# Altium project G-Board-G070.PrjPcb
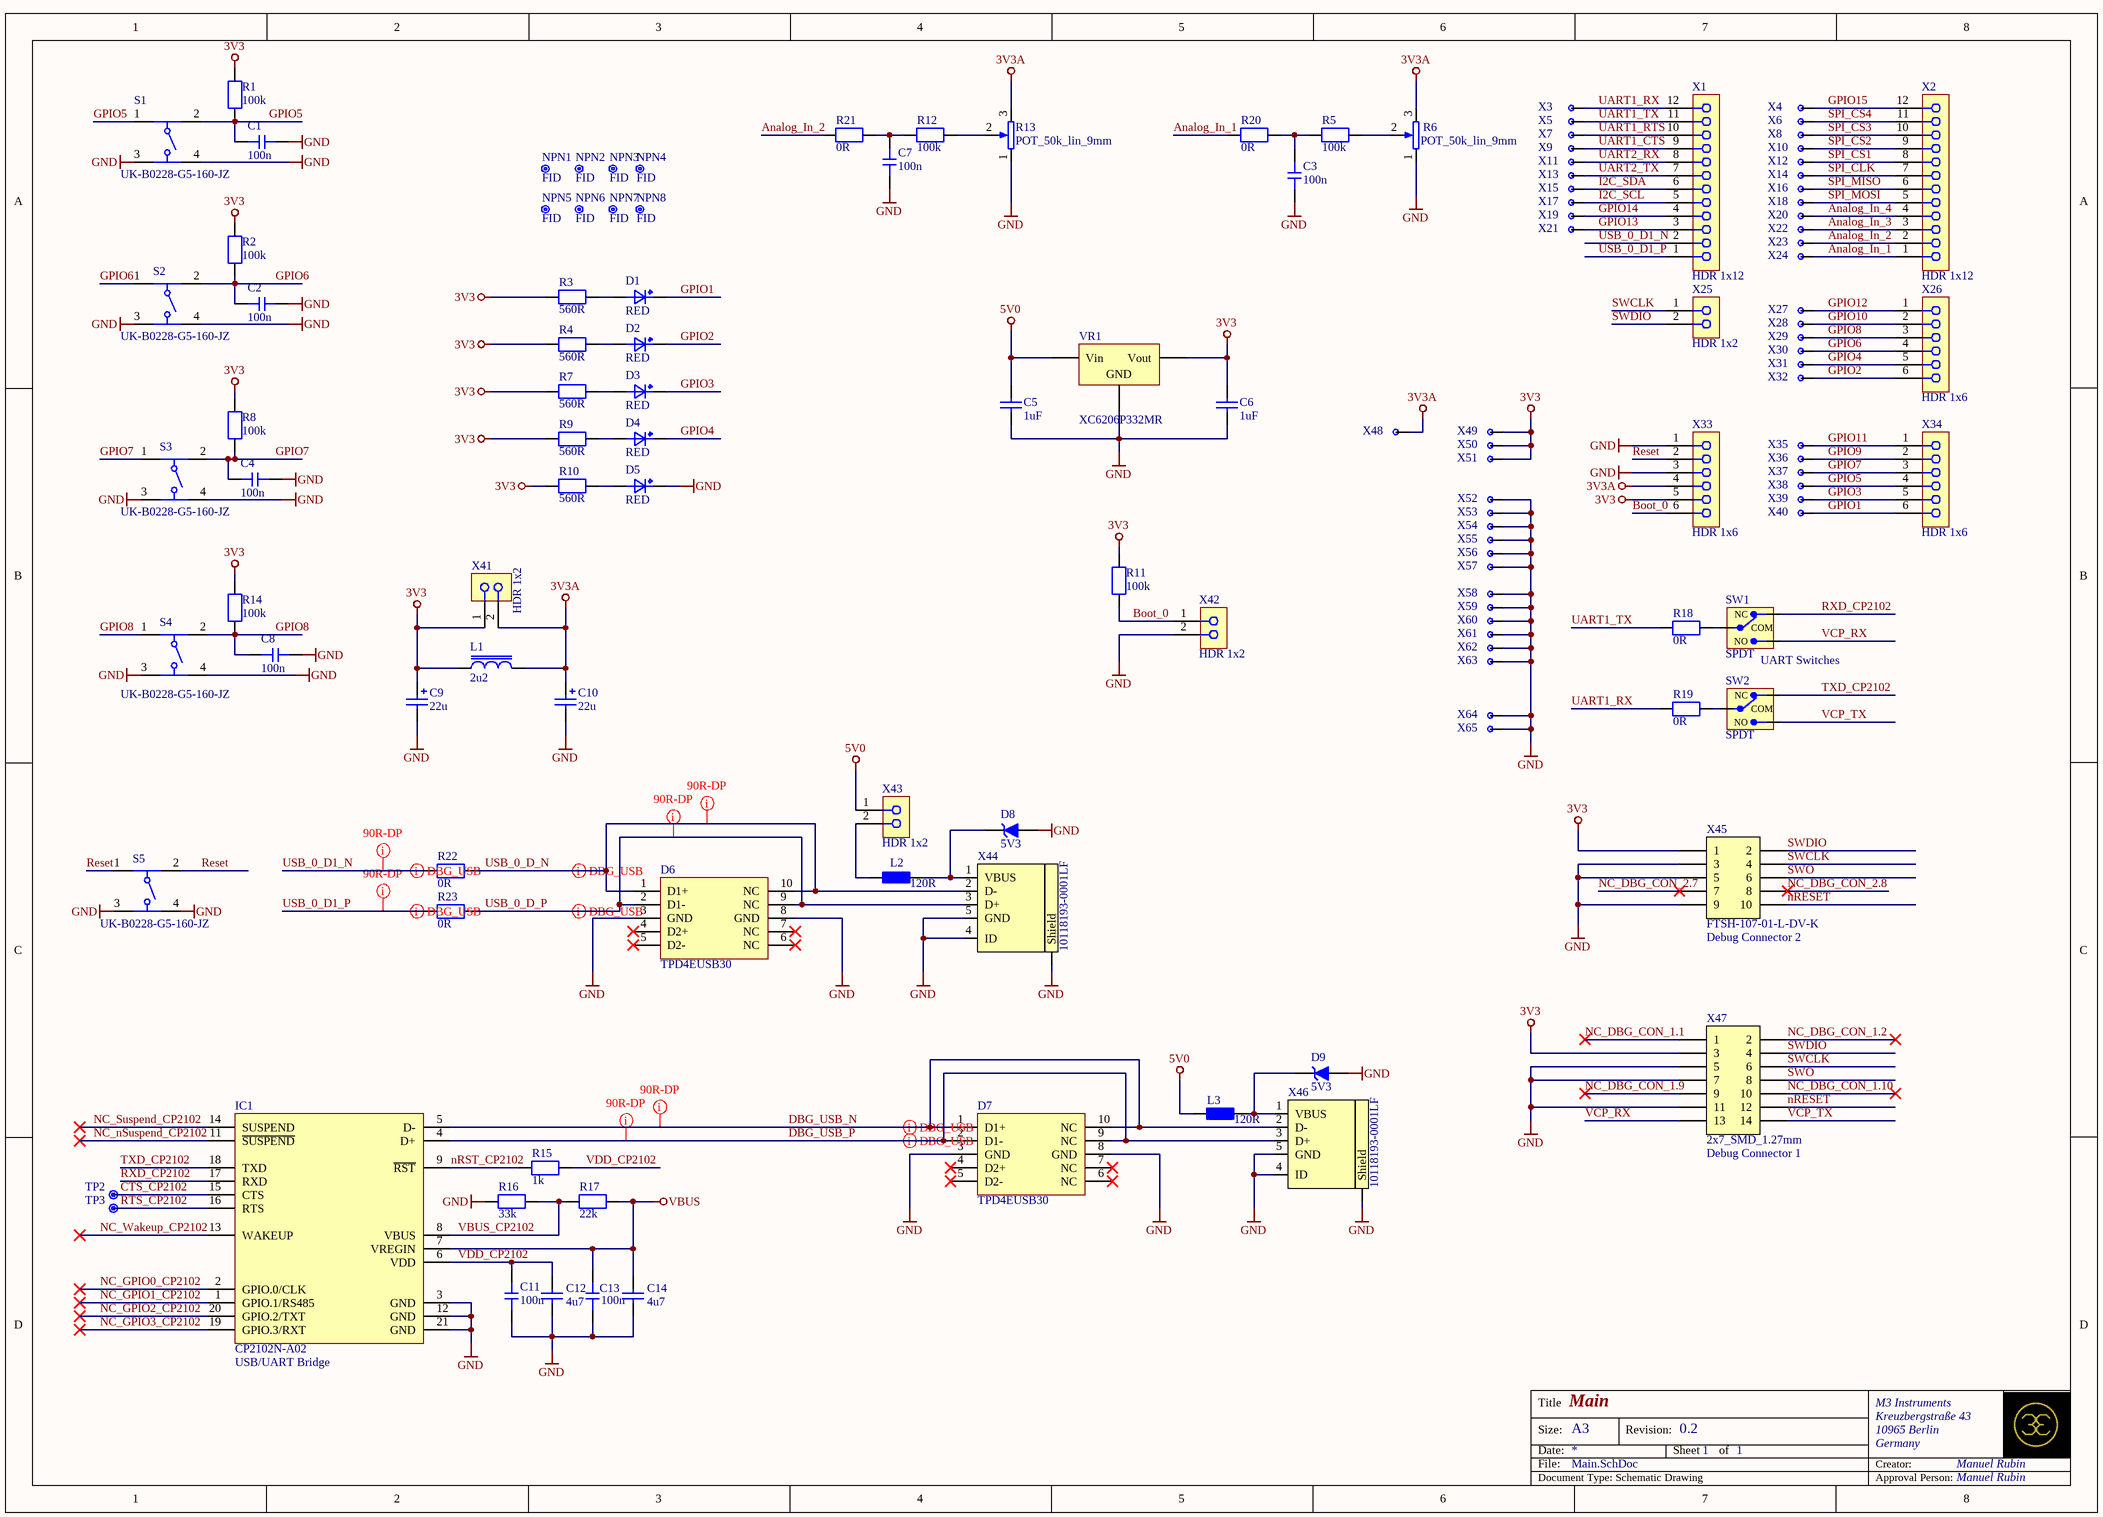
[diagram p0: Main.SchDoc]
address2: Kreuzbergstraße 43; address3: 10965 Berlin; address4: Germany; ApprovalSchematic: Manuel Rubin; CompanyName: M3 Instruments; CreatorSchematic: Manuel Rubin; ProjectRevision: 0.2
1 sheet, 133 parts. Net scope: global (net labels, ports and power ports of the same name join across sheets).
Board file: erb-pcb0004.PcbDoc

## Sheet Main.SchDoc: Main
size A3; Author: Manuel Rubin; Revision: 0.1; SheetNumber: 1; SheetTotal: 1

### Parts
C1  100n  [CAPC1608X95N]
C2  100n  [CAPC1608X95N]
C3  100n  [CAPC1608X95N]
C4  100n  [CAPC1608X95N]
C5  1uF  [0603_C]
C6  1uF  [0603_C]
C7  100n  [CAPC1608X95N]
C8  100n  [CAPC1608X95N]
C9  22u  [CAPAE4643X54M]
C10  22u  [CAPAE4643X54M]
C11  100n  [CAPC1608X95N]
C12  4u7  [CAPC1608X95N]
C13  100n  [CAPC1608X95N]
C14  4u7  [CAPC1608X95N]
D1  RED  [WL-SMCW_0805]
D2  RED  [WL-SMCW_0805]
D3  RED  [WL-SMCW_0805]
D4  RED  [WL-SMCW_0805]
D5  RED  [WL-SMCW_0805]
D6  TPD4EUSB30  [DQA R-PUSON-N10]
D7  TPD4EUSB30  [DQA R-PUSON-N10]
D8  5V3  [SODFL100X40-2N]
D9  5V3  [SODFL100X40-2N]
IC1  CP2102N-A02  DevNote: USB/UART Bridge  [SILABS_CP2102N-A02-GQFN20R]
L1  2u2  [INDP5050X39N]
L2  120R  [INDC1608X95AN]
L3  120R  [INDC1608X95AN]
NPN1  FID  [Fiducial_1mm]
NPN2  FID  [Fiducial_1mm]
NPN3  FID  [Fiducial_1mm]
NPN4  FID  [Fiducial_1mm]
NPN5  FID  [Fiducial_1mm]
NPN6  FID  [Fiducial_1mm]
NPN7  FID  [Fiducial_1mm]
NPN8  FID  [Fiducial_1mm]
R1  100k  [RESC2012X70N]
R2  100k  [RESC2012X70N]
R3  560R  [RESC2012X70N]
R4  560R  [RESC2012X70N]
R5  100k  [RESC2012X70N]
R6  POT_50k_lin_9mm  [PTV09]
R7  560R  [RESC2012X70N]
R8  100k  [RESC2012X70N]
R9  560R  [RESC2012X70N]
R10  560R  [RESC2012X70N]
R11  100k  [RESC2012X70N]
R12  100k  [RESC2012X70N]
R13  POT_50k_lin_9mm  [PTV09]
R14  100k  [RESC2012X70N]
R15  1k  [RESC1608X55AN]
R16  33k  [RESC1608X55AN]
R17  22k  [RESC1608X55AN]
R18  0R  [RESC1608X55N]
R19  0R  [RESC1608X55N]
R20  0R  [RESC1608X55N]
R21  0R  [RESC1608X55N]
R22  0R  [RESC1608X55N]
R23  0R  [RESC1608X55N]
S1  UK-B0228-G5-160-JZ  [UK-B0228-G5-160-JZ]
S2  UK-B0228-G5-160-JZ  [UK-B0228-G5-160-JZ]
S3  UK-B0228-G5-160-JZ  [UK-B0228-G5-160-JZ]
S4  UK-B0228-G5-160-JZ  [UK-B0228-G5-160-JZ]
S5  UK-B0228-G5-160-JZ  [UK-B0228-G5-160-JZ]
SW1  SPDT  DevNote: UART Switches  [SW_JS102011JCQN]
SW2  SPDT  [SW_JS102011JCQN]
TP2  TP 0.7mm  [TP_0.7mm]  (value not drawn)  (no BOM)
TP3  TP 0.7mm  [TP_0.7mm]  (value not drawn)  (no BOM)
VR1  XC6206P332MR  [SOT-23-3L]
X1  HDR 1x12  [61301211821_NO]
X2  HDR 1x12  [61301211821_NO]
X3  PAD  [PAD_1.1_1.6]  (value not drawn)  (net tie, no BOM)
X4  PAD  [PAD_1.1_1.6]  (value not drawn)  (net tie, no BOM)
X5  PAD  [PAD_1.1_1.6]  (value not drawn)  (net tie, no BOM)
X6  PAD  [PAD_1.1_1.6]  (value not drawn)  (net tie, no BOM)
X7  PAD  [PAD_1.1_1.6]  (value not drawn)  (net tie, no BOM)
X8  PAD  [PAD_1.1_1.6]  (value not drawn)  (net tie, no BOM)
X9  PAD  [PAD_1.1_1.6]  (value not drawn)  (net tie, no BOM)
X10  PAD  [PAD_1.1_1.6]  (value not drawn)  (net tie, no BOM)
X11  PAD  [PAD_1.1_1.6]  (value not drawn)  (net tie, no BOM)
X12  PAD  [PAD_1.1_1.6]  (value not drawn)  (net tie, no BOM)
X13  PAD  [PAD_1.1_1.6]  (value not drawn)  (net tie, no BOM)
X14  PAD  [PAD_1.1_1.6]  (value not drawn)  (net tie, no BOM)
X15  PAD  [PAD_1.1_1.6]  (value not drawn)  (net tie, no BOM)
X16  PAD  [PAD_1.1_1.6]  (value not drawn)  (net tie, no BOM)
X17  PAD  [PAD_1.1_1.6]  (value not drawn)  (net tie, no BOM)
X18  PAD  [PAD_1.1_1.6]  (value not drawn)  (net tie, no BOM)
X19  PAD  [PAD_1.1_1.6]  (value not drawn)  (net tie, no BOM)
X20  PAD  [PAD_1.1_1.6]  (value not drawn)  (net tie, no BOM)
X21  PAD  [PAD_1.1_1.6]  (value not drawn)  (net tie, no BOM)
X22  PAD  [PAD_1.1_1.6]  (value not drawn)  (net tie, no BOM)
X23  PAD  [PAD_1.1_1.6]  (value not drawn)  (net tie, no BOM)
X24  PAD  [PAD_1.1_1.6]  (value not drawn)  (net tie, no BOM)
X25  HDR 1x2  [61300211821_NO]
X26  HDR 1x6  [61300611821_NO]
X27  PAD  [PAD_1.1_1.6]  (value not drawn)  (net tie, no BOM)
X28  PAD  [PAD_1.1_1.6]  (value not drawn)  (net tie, no BOM)
X29  PAD  [PAD_1.1_1.6]  (value not drawn)  (net tie, no BOM)
X30  PAD  [PAD_1.1_1.6]  (value not drawn)  (net tie, no BOM)
X31  PAD  [PAD_1.1_1.6]  (value not drawn)  (net tie, no BOM)
X32  PAD  [PAD_1.1_1.6]  (value not drawn)  (net tie, no BOM)
X33  HDR 1x6  [61300611821_NO]
X34  HDR 1x6  [61300611821_NO]
X35  PAD  [PAD_1.1_1.6]  (value not drawn)  (net tie, no BOM)
X36  PAD  [PAD_1.1_1.6]  (value not drawn)  (net tie, no BOM)
X37  PAD  [PAD_1.1_1.6]  (value not drawn)  (net tie, no BOM)
X38  PAD  [PAD_1.1_1.6]  (value not drawn)  (net tie, no BOM)
X39  PAD  [PAD_1.1_1.6]  (value not drawn)  (net tie, no BOM)
X40  PAD  [PAD_1.1_1.6]  (value not drawn)  (net tie, no BOM)
X41  HDR 1x2  [CON_HEADER2.54_1x2W]
X42  HDR 1x2  [CON_HEADER2.54_1x2W]
X43  HDR 1x2  [CON_HEADER2.54_1x2W]
X44  10118193-0001LF  [USB-Micro-B-RA-SMD-PiP]
X45  FTSH-107-01-L-DV-K  DevNote: Debug Connector 2  [HDR_2x5-SMD-1.27mm-K]
X46  10118193-0001LF  [USB-Micro-B-RA-SMD-PiP]
X47  2x7_SMD_1.27mm  DevNote: Debug Connector 1  [FTSH-107-01-L-DV-K]
X48  PAD  [PAD_1.1_1.6]  (value not drawn)  (net tie, no BOM)
X49  PAD  [PAD_1.1_1.6]  (value not drawn)  (net tie, no BOM)
X50  PAD  [PAD_1.1_1.6]  (value not drawn)  (net tie, no BOM)
X51  PAD  [PAD_1.1_1.6]  (value not drawn)  (net tie, no BOM)
X52  PAD  [PAD_1.1_1.6]  (value not drawn)  (net tie, no BOM)
X53  PAD  [PAD_1.1_1.6]  (value not drawn)  (net tie, no BOM)
X54  PAD  [PAD_1.1_1.6]  (value not drawn)  (net tie, no BOM)
X55  PAD  [PAD_1.1_1.6]  (value not drawn)  (net tie, no BOM)
X56  PAD  [PAD_1.1_1.6]  (value not drawn)  (net tie, no BOM)
X57  PAD  [PAD_1.1_1.6]  (value not drawn)  (net tie, no BOM)
X58  PAD  [PAD_1.1_1.6]  (value not drawn)  (net tie, no BOM)
X59  PAD  [PAD_1.1_1.6]  (value not drawn)  (net tie, no BOM)
X60  PAD  [PAD_1.1_1.6]  (value not drawn)  (net tie, no BOM)
X61  PAD  [PAD_1.1_1.6]  (value not drawn)  (net tie, no BOM)
X62  PAD  [PAD_1.1_1.6]  (value not drawn)  (net tie, no BOM)
X63  PAD  [PAD_1.1_1.6]  (value not drawn)  (net tie, no BOM)
X64  PAD  [PAD_1.1_1.6]  (value not drawn)  (net tie, no BOM)
X65  PAD  [PAD_1.1_1.6]  (value not drawn)  (net tie, no BOM)

### Nets
3V3: C6.2 C9.1 L1.1 R1.2 R2.2 R3.1 R4.1 R7.1 R8.2 R9.1 R10.1 R11.2 R14.2 VR1.2(Vout) X33.5 X41.1 X45.1 X47.3 X49.1 X50.1 X51.1
3V3A: C10.1 L1.2 R6.3 R13.3 X33.4 X41.2 X48.1
5V0: C5.2 L3.1 VR1.3(Vin) X43.1
GND: C1.2 C2.2 C3.2 C4.2 C5.1 C6.1 C7.2 C8.2 C9.2 C10.2 C11.1 C12.1 C13.1 C14.1 D5.K D6.3(GND) D6.8(GND) D7.3(GND) D7.8(GND) D8.A D9.A IC1.3(GND) IC1.12(GND) IC1.21(GND) R6.1 R13.1 R16.2 S1.3 S1.4 S2.3 S2.4 S3.3 S3.4 S4.3 S4.4 S5.3 S5.4 VR1.1(GND) X33.1 X33.3 X42.2 X44.4(ID) X44.5(GND) X44.6(Shield) X45.3 X45.5 X45.9 X46.4(ID) X46.5(GND) X46.6(Shield) X47.5 X47.7 X47.11 X52.1 X53.1 X54.1 X55.1 X56.1 X57.1 X58.1 X59.1 X60.1 X61.1 X62.1 X63.1 X64.1 X65.1
VBUS: C13.2 C14.2 IC1.7(VREGIN) R17.1
Analog_In_1: R20.2 X2.1 X24.1
Analog_In_2: R21.2 X2.2 X23.1
Analog_In_3: X2.3 X22.1
Analog_In_4: X2.4 X20.1
Boot_0: R11.1 X33.6 X42.1
CTS_CP2102: IC1.15(CTS) TP2.1
DBG_USB_N: D7.1(D1+) D7.10(NC) IC1.5(D-) X46.2(D-)
DBG_USB_P: D7.2(D1-) D7.9(NC) IC1.4(D+) X46.3(D+)
GPIO1: D1.K X34.6 X40.1
GPIO2: D2.K X26.6 X32.1
GPIO3: D3.K X34.5 X39.1
GPIO4: D4.K X26.5 X31.1
GPIO5: C1.1 R1.1 S1.1 S1.2 X34.4 X38.1
GPIO6: C2.1 R2.1 S2.1 S2.2 X26.4 X30.1
GPIO7: C4.1 R8.1 S3.1 S3.2 X34.3 X37.1
GPIO8: C8.1 R14.1 S4.1 S4.2 X26.3 X29.1
GPIO9: X34.2 X36.1
GPIO10: X26.2 X28.1
GPIO11: X34.1 X35.1
GPIO12: X26.1 X27.1
GPIO13: X1.3 X21.1
GPIO14: X1.4 X19.1
GPIO15: X2.12 X4.1
I2C_SCL: X1.5 X17.1
I2C_SDA: X1.6 X15.1
NC_DBG_CON_1.1: X47.1
NC_DBG_CON_1.2: X47.2
NC_DBG_CON_1.9: X47.9
NC_DBG_CON_1.10: X47.10
NC_DBG_CON_2.7: X45.7
NC_DBG_CON_2.8: X45.8
NC_GPIO0_CP2102: IC1.2(GPIO.0/CLK)
NC_GPIO1_CP2102: IC1.1(GPIO.1/RS485)
NC_GPIO2_CP2102: IC1.20(GPIO.2/TXT)
NC_GPIO3_CP2102: IC1.19(GPIO.3/RXT)
NC_nSuspend_CP2102: IC1.11(~{SUSPEND})
NC_Suspend_CP2102: IC1.14(SUSPEND)
NC_Wakeup_CP2102: IC1.13(WAKEUP)
nRESET: X45.10 X47.12
nRST_CP2102: IC1.9(~{RST}) R15.2
Reset: S5.1 S5.2 X33.2
RTS_CP2102: IC1.16(RTS) TP3.1
RXD_CP2102: IC1.17(RXD) SW1.1(NC)
SPI_CLK: X2.7 X14.1
SPI_CS1: X2.8 X12.1
SPI_CS2: X2.9 X10.1
SPI_CS3: X2.10 X8.1
SPI_CS4: X2.11 X6.1
SPI_MISO: X2.6 X16.1
SPI_MOSI: X2.5 X18.1
SWCLK: X25.1 X45.4 X47.6
SWDIO: X25.2 X45.2 X47.4
SWO: X45.6 X47.8
TXD_CP2102: IC1.18(TXD) SW2.1(NC)
UART1_CTS: X1.9 X9.1
UART1_RTS: X1.10 X7.1
UART1_RX: R19.2 X1.12 X3.1
UART1_TX: R18.2 X1.11 X5.1
UART2_RX: X1.8 X11.1
UART2_TX: X1.7 X13.1
USB_0_D1_N: R22.2 X1.2
USB_0_D1_P: R23.2 X1.1
USB_0_D_N: D6.1(D1+) D6.10(NC) R22.1 X44.2(D-)
USB_0_D_P: D6.2(D1-) D6.9(NC) R23.1 X44.3(D+)
VBUS_CP2102: IC1.8(VBUS) R16.1 R17.2
VCP_RX: SW1.3(NO) X47.13
VCP_TX: SW2.3(NO) X47.14
VDD_CP2102: C11.2 C12.2 IC1.6(VDD) R15.1
NetC3_1: C3.1 R5.1 R20.1
NetC7_1: C7.1 R12.1 R21.1
NetD1_A: D1.A R3.2
NetD2_A: D2.A R4.2
NetD3_A: D3.A R7.2
NetD4_A: D4.A R9.2
NetD5_A: D5.A R10.2
NetD8_K: D8.K L2.2 X44.1(VBUS)
NetD9_K: D9.K L3.2 X46.1(VBUS)
NetL2_1: L2.1 X43.2
NetR5_2: R5.2 R6.2
NetR12_2: R12.2 R13.2
NetR18_1: R18.1 SW1.2(COM)
NetR19_1: R19.1 SW2.2(COM)

Not connected (* = marked no-connect by the designer): D6 4(D2+)* 5(D2-)* 6(NC)* 7(NC)*; D7 4(D2+)* 5(D2-)* 6(NC)* 7(NC)*

### Layout directives
differential pair: DBG_USB_N, DBG_USB_P, USB_0_D1_N, USB_0_D1_P, USB_0_D_N, USB_0_D_P
net class 90R-DP: DBG_USB_N, DBG_USB_P, USB_0_D1_N, USB_0_D1_P, USB_0_D_N, USB_0_D_P

### Notes on the sheet
- Title
- Size:
- Date:
- File:
- A3
- Revision:
- Sheet
- of
- Creator:
- Document Type: Schematic Drawing
- Approval Person:

### Library data of the parts
C1 C2 C4 C8 C11 C13 = C_100n_50V_0603: 100n_50V; Manufacturer: AVX; Manufacturer Part Number: 06031C104KAT2A; Voltage Rating: 50V; Tolerance: +-10%; Alternatives allowed: YES; Notes: X7R, 0603; Value: 100nF; JLC: C14663
C3 C7 = 100n_50V: Manufacturer: AVX; Manufacturer Part Number: 06031C104KAT2A; Voltage Rating: 100V; Tolerance: +-10%; Alternatives allowed: YES; Notes: X7R, 0603; Value: 100nF
C5 C6 = 0603 1uF (105) 10% 50V: Chip capacitors; Manufacturer: Samsung Electro-Mechanics; PartNumber: CL10A105KB8NNNC; Tolerance: 10%; Voltage: 50V; ComponentLink1Description: Supplier link; ComponentLink1URL: http://www.szlcsc.com/product/details_16531.html; Package: 0603; Supplier: LC; SuppliersPartNumber: C15849; Capacitance: 1uF
C9 C10 = CAP_22u: Aluminium Electrolytic Capacitors - SMD 22UF 16V HA SMD; Manufacturer: Panasonic; Manufacturer Part Number: EEE-HAC220WAR; Tolerance: 20%; Alternatives allowed: NO; Voltage Rating: 16V
C12 C14 = CAP_4u7_0603: 16V 4.7uF X5R ±10% 0603 Multilayer Ceramic Capacitors MLCC - SMD/SMT ROHS; Manufacturer: Murata Electronics; Manufacturer Part Number: GRM188C81C475KE11D; Voltage Rating: 16VDC; Alternatives allowed: yes; Tolerance: 10%; JLC: C19666
D1-D5 = LED_0805_RED_AK: Standard LEDs - SMD WL-SMCW SMDMono TpVw Waterclr 0805 Red; Manufacturer: Wurth Elektronik; Manufacturer Part Number: 150080RS75000; Voltage Rating: 2.0; Alternatives allowed: YES; JLC: C84256
D6 D7 = TPD4EUSB30DQAR: 2-, 4-Channel ESD Protection for Super-Speed USB 3.0 Interface; Manufacturer: Texas Instruments; Alternatives allowed: NO; Manufacturer Part Number: TPD4EUSB30DQAR
D8 D9 = DIO_TVS_5V3: ESD Suppressors / TVS Diodes WE-VE 0603 USB 2.0 5V 10MoHM; Manufacturer: onsemi; Manufacturer Part Number: SZESD7371P2T5G; Alternatives allowed: YES; Voltage Rating: 5V3; JLC: C896553
IC1 = IC_CP2102N-A02-QFN20: USB Interface IC USBXpress - USB to UART Bridge QFN28; Manufacturer: Silicon Labs; Manufacturer Part Number: CP2102N-A02-GQFN20R; Alternatives allowed: NO; ComponentLink1URL: *; ComponentLink1Description: Datasheet; ComponentLink2URL: *; ComponentLink2Description: Supplier link; Voltage Rating: *; JLC: C969913
L1 = IND_2u2_3.8A: Fixed Inductors 2.2uH 3.8A; Manufacturer: Bourns; Manufacturer Part Number: SRN5040TA-2R2M; Voltage Rating: 50V; Tolerance: 10%; Alternatives allowed: yes; JLC: N/A
L2 L3 = FB_120R_0603: Chip Bead Inductors for Power Lines; Manufacturer: Taiyo Yuden; Manufacturer Part Number: FBMH1608HL121-T; Alternatives allowed: YES; Notes: 0603, 1,2A; Value: 120R
NPN1-NPN8 = Fiducial_1mm
R1 R2 R5 R8 R11 R12 R14 = RES_100k_0805: Thick Film Resistors - SMD 1/8watt 100Kohms 1% 100ppm; Manufacturer: Vishay / Dale; Manufacturer Part Number: CRCW0805100KFKEA; Voltage Rating: 150V; Alternatives allowed: YES; Tolerance: 1%; JLC: C17407
R3 R4 R7 R9 R10 = RES_560R_0805: Thick Film Resistors - SMD 560 Ohms 125 mW 0805 1%; Manufacturer: YAGEO; Manufacturer Part Number: RC0805FR-10560RL; Voltage Rating: 150V; Alternatives allowed: YES; Tolerance: 1%
R6 R13 = POT_50k_lin_9mm: Potentiometers PANEL CONTROL - 9MM-ST-CA 50 kohms 30 mm; Manufacturer: Bourns; Manufacturer Part Number: PTV09A-4030S-A503; Tolerance: 20%
R15 = RES_1k_0603: Thick Film Resistors - SMD 1 kOhms 100mW 0603 1%; Manufacturer: Yageo; Manufacturer Part Number: RC0603FR-071KL; Voltage Rating: 75V; Alternatives allowed: YES; Tolerance: 1%; JLC: C21190
R16 = RES_33k_0603: Thick Film Resistors - SMD 33 kOhms 100 mW 0603 5%; Manufacturer: YAGEO; Manufacturer Part Number: RC0603JR-0733KL; Voltage Rating: 50V; Tolerance: 1%; Alternatives allowed: YES; JLC: C4216
R17 = RES_22k_0603: Thick Film Resistors - SMD 22kOhms 1/10W 0603 1%; Manufacturer: YAGEO; Manufacturer Part Number: RC0603FR-7W22KL; Voltage Rating: 75V; Alternatives allowed: YES; Tolerance: 1%; JLC: C31850
R18-R23 = RES_0R_0603: Thick Film Resistors - SMD 1/10watt ZEROohm Jumper; Manufacturer: Vishay; Manufacturer Part Number: CRCW06030000Z0EA; Voltage Rating: 75V; Tolerance: 1%; Alternatives allowed: YES; JLC: C21189
S1-S5 = SW_UK-B0228-G5-160-JZ: No NO Gull Wing 50mA 6mm 100MΩ 100000 12V 160gf@±50gf -20℃~+70℃ 6mm 5mm Black Round Button Brick nogging SPST SMD Tactile Switches ROHS; Manufacturer: USAKRO; Manufacturer Part Number: UK-B0228-G5-160-JZ; JLC: C620316
SW1 SW2 = SW_JS102011JCQN: Slide Switch SPDT Surface Mount; Manufacturer: C&K; Manufacturer Part Number: JS102011JCQN; JLC: C221659
TP2 TP3 = MISC_Test Pad 0.7mm: Test Pad surface mount; Notes: Test Pad Only; Alternatives allowed: NO; Manufacturer: N/A; Manufacturer Part Number: N/A
VR1 = SOT-23 XC6206P332MR: 低压差线性稳压(LDO); ComponentLink1Description: 供应商链接; ComponentLink1URL: http://www.szlcsc.com/product/details_5896.html; Package: SOT-23; Supplier: LC; SuppliersPartNumber: C5446
X1 X2 = CON_HEADER_1X12_FEMALE_NO: Board-to-Board-Steckverbinder, 2.54 mm, 12 Kontakt(e), Stiftleiste 1-Reihig; Manufacturer: WE; Manufacturer Part Number: 61301211821; Alternatives allowed: YES
X3-X24 X27-X32 X35-X40 X48-X65 = PAD_2.54
X25 = CON_HEADER_1X2_FEMALE_NO: Board-to-Board-Steckverbinder, 2.54 mm, 2 Kontakt(e), Stiftleiste 1-Reihig; Manufacturer: WE; Manufacturer Part Number: 61300211821; Lumira Part Number: S-QMS-SPEC-32507; Alternatives allowed: YES
X26 X33 X34 = CON_HEADER_1X6_FEMALE_NO: Board-to-Board-Steckverbinder, 2.54 mm, 6 Kontakt(e), Stiftleiste 1-Reihig; Manufacturer: WE; Manufacturer Part Number: 61300611821; Alternatives allowed: YES
X41-X43 = CON_HEADER_1X2: Board-to-Board-Steckverbinder, 2.54 mm, 2 Kontakt(e), Stiftleiste 1-Reihig; Manufacturer: Samtec; Manufacturer Part Number: TSW-102-07-T-S; Lumira Part Number: S-QMS-SPEC-32507; Alternatives allowed: YES
X44 X46 = CON_MiniUSB-AB-SMT: MicroUSB-B-SMT; Manufacturer: Amphenol ICC (FCI); Manufacturer Part Number: 10118193-0001LF; ComponentLink1URL: *; ComponentLink1Description: Datasheet; ComponentLink2URL: *; ComponentLink2Description: Supplier link
X45 = CON_2x5_SMD_1.27mm: Pin Header 2x5, 1.27mm (50mil), SMD, Keying Shroud; Manufacturer: Samtec; Manufacturer Part Number: FTSH-105-01-L-DV-K; Value: Pin Header 2x5, 1.27mm; ComponentLink1URL: *; ComponentLink1Description: Datasheet; ComponentLink2URL: *; ComponentLink2Description: Supplier link
X47 = CON_2x7_SMD_1.27mm: Headers & Wire Housings High Reliability Header Strips, 0.050 pitch, 2 x 7; Manufacturer: Samtec; Manufacturer Part Number: FTSH-107-04-F-DV-P-TR; Value: Pin Header 2x7, 1.27mm; Note: *; ComponentLink1URL: *; ComponentLink1Description: Datasheet; ComponentLink2URL: *; ComponentLink2Description: Supplier link; JLC: *